# EAGLE design Envelopekut (EAGLE 9.6.2)
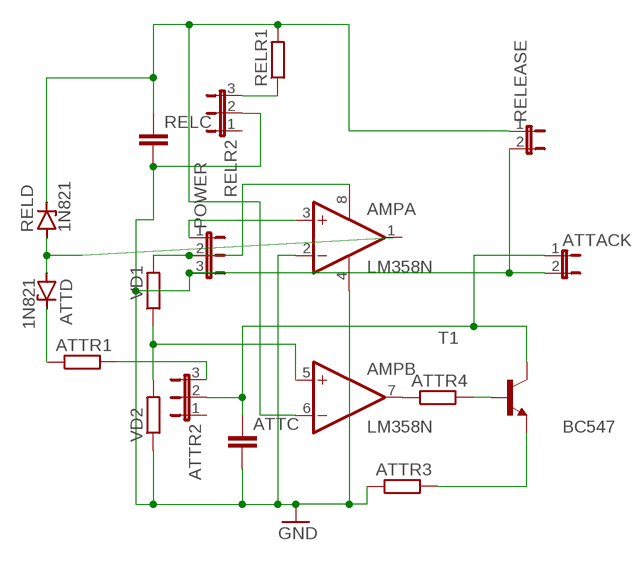
[diagram p0: schematic, sheet 1]

## Parts
AMP  LM358N  [DIL08]
ATTACK  JP1E  [JP1]
ATTC  C-EU025-025X050  [C025-025X050]
ATTD  1N821  [DO35Z10]
ATTR1  R-EU_0207/10  [0207/10]
ATTR2  JP2E  [JP2]
ATTR3  R-EU_0207/10  [0207/10]
ATTR4  R-EU_0207/10  [0207/10]
POWER  JP2E  [JP2]
RELC  C-EU025-025X050  [C025-025X050]
RELD  1N821  [DO35Z10]
RELEASE  JP1E  [JP1]
RELR1  R-EU_0207/10  [0207/10]
RELR2  JP2E  [JP2]
T1  BC547  [TO92]
VD1  R-EU_0207/10  [0207/10]
VD2  R-EU_0207/10  [0207/10]

## Nets
GND: AMP.2(A:-IN) AMP.4(P:V-) ATTACK.2 ATTC.2 ATTR3.1 POWER.3 RELC.2 RELEASE.2 RELR2.2 VD2.1
N$1: AMP.5(B:+IN) VD1.1 VD2.2
N$2: AMP.7(B:OUT) ATTR4.1
N$3: ATTR4.2 T1.2(B)
N$4: ATTR1.2 ATTR2.3
N$5: ATTR3.2 T1.1(E)
N$6: ATTACK.1 ATTC.1 ATTR2.2 T1.3(C)
N$7: ATTD.C ATTR1.1
N$8: AMP.1(A:OUT) ATTD.A RELD.A
N$9: AMP.8(P:V+) POWER.2 VD1.2
N$10: AMP.3(A:+IN) POWER.1
N$11: AMP.6(B:-IN) RELC.1 RELD.C RELEASE.1 RELR1.2
N$12: RELR1.1 RELR2.3
Unconnected: ATTR2.1 RELR2.1

## Library data of the parts
AMP = linear:LM358: OP AMP also LM158; LM258; LM2904 Source: http://cache.national.com/ds/LM/LM158.pdf
ATTACK RELEASE = jumper:JP1E: JUMPER
ATTC RELC = rcl:C-EU: CAPACITOR, European symbol; SPICEPREFIX: C
ATTD RELD = diode:1N821: Reference DIODE temperature compensated, 6,2 V
ATTR1 ATTR3 ATTR4 RELR1 VD1 VD2 = rcl:R-EU_: RESISTOR, European symbol; SPICEPREFIX: R
ATTR2 POWER RELR2 = jumper:JP2E: JUMPER
T1 = transistor:BC547: NPN TRANSISTOR

## Board
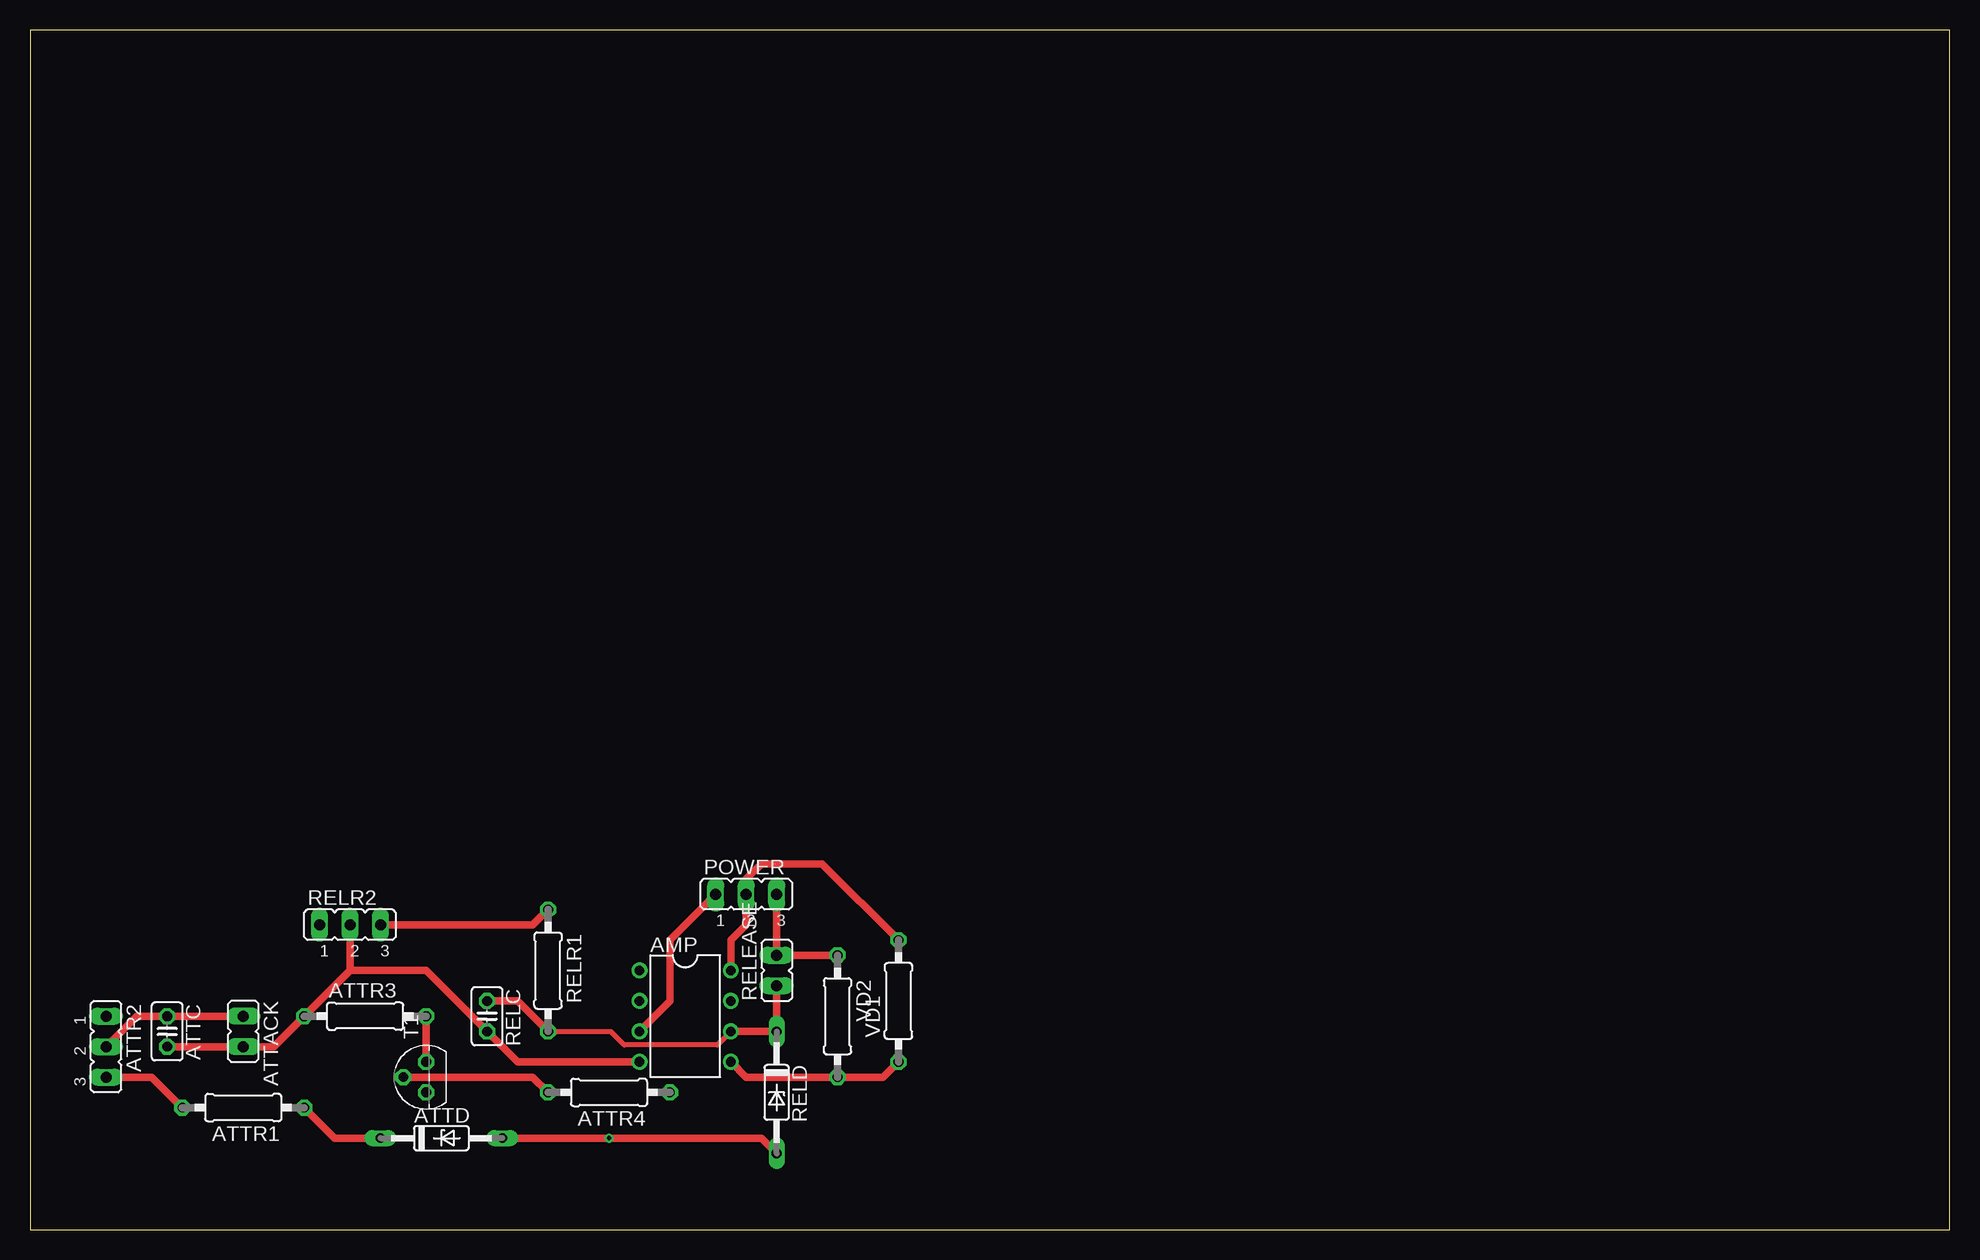
[diagram p1: board, top side]
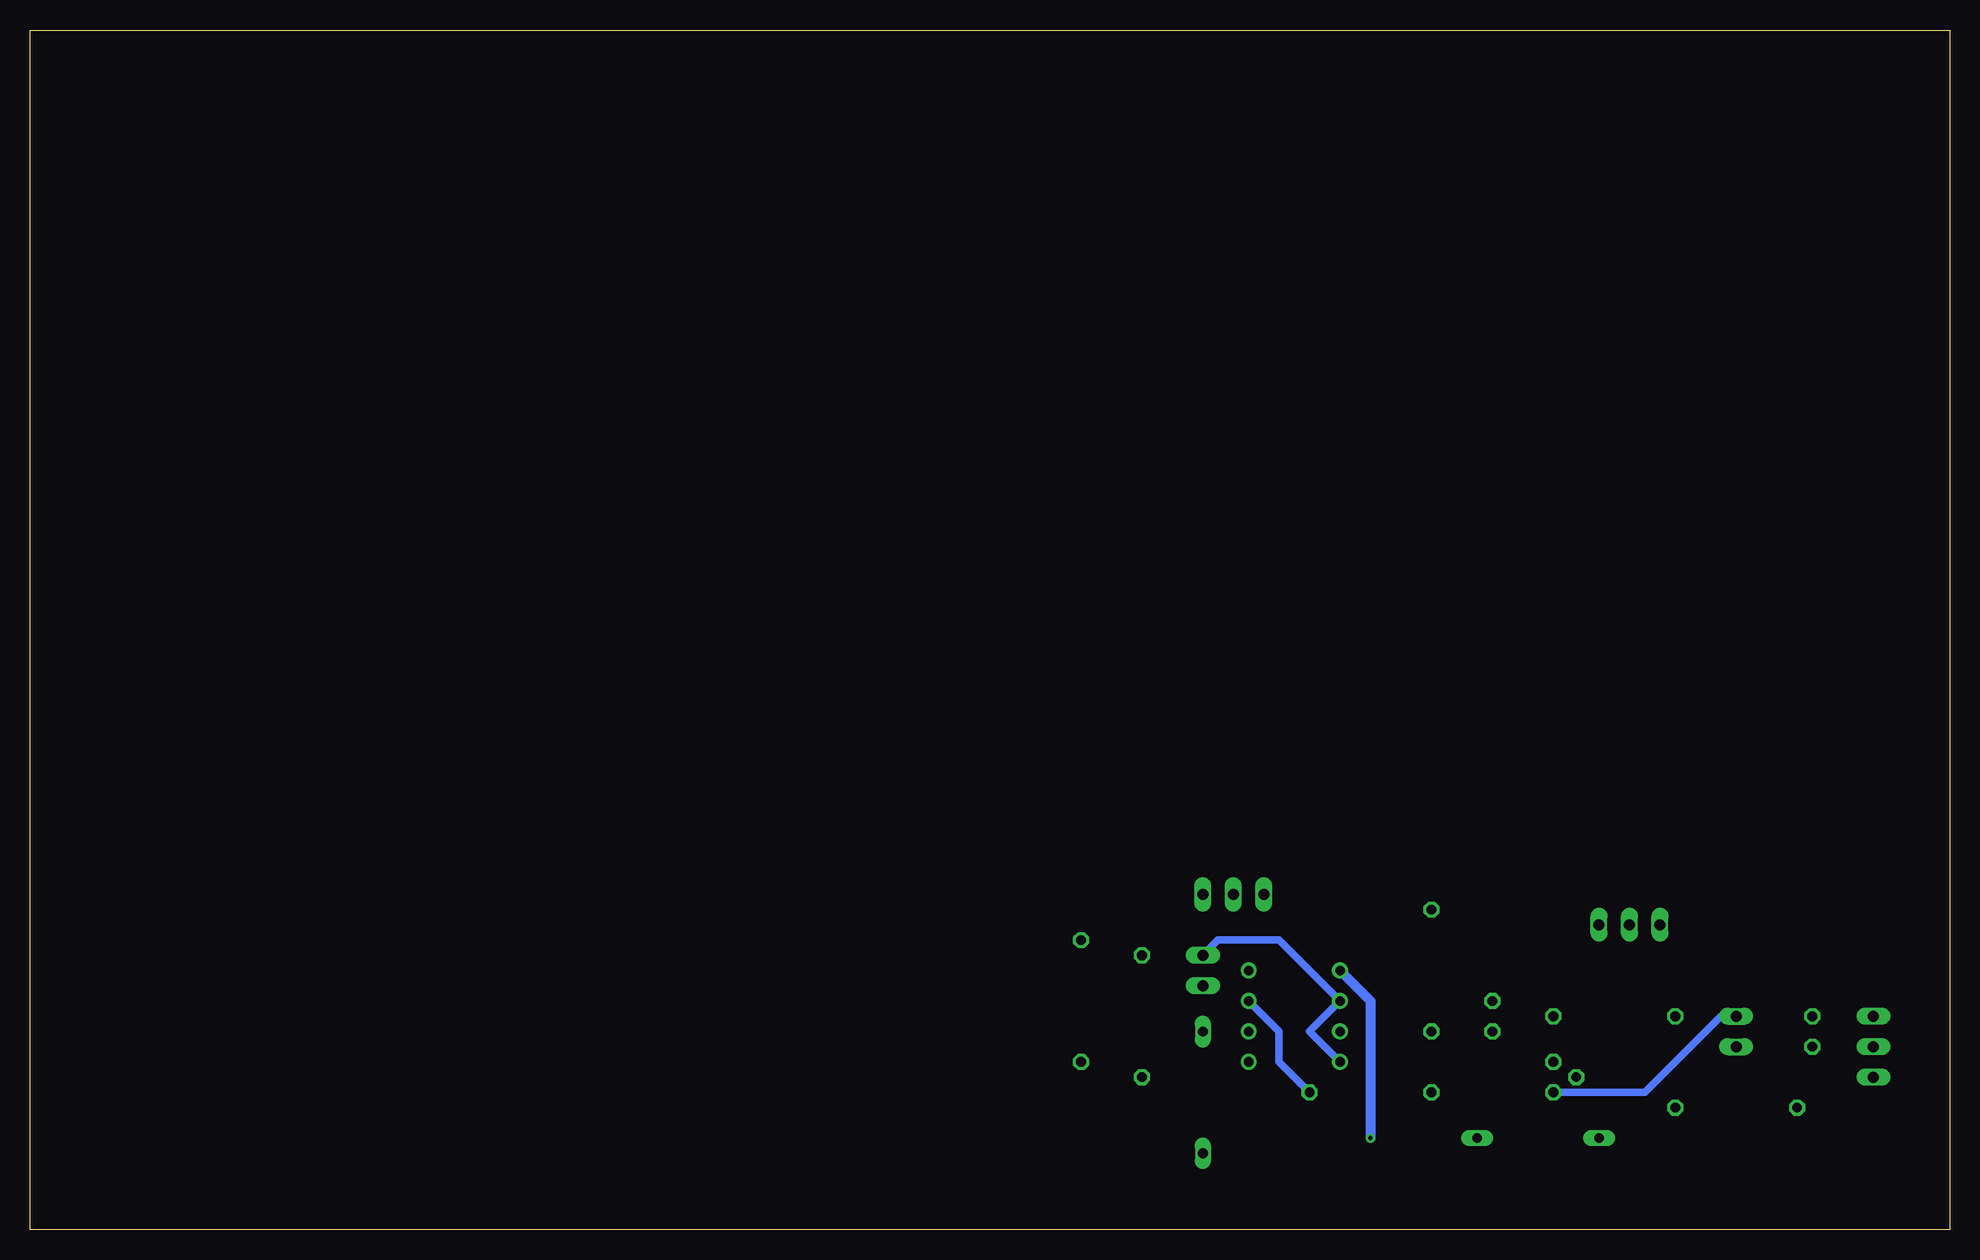
[diagram p2: board, bottom side, seen from below]

Size 160 x 100 mm. Coordinates in mm from the lower left corner, seen from the top.
Outline: 0,0 160,0 160,100 0,100 0,0
Copper layers (1*16): Top 0.035mm / dielectric 1.5mm / Bottom 0.035mm
Design rules "default": minimum track width 6mil, minimum drill 0.35mm, track to track 6mil, track to pad 6mil, pad to pad 6mil, via to via 6mil, smd to smd 6mil, copper to edge 40mil, drill to drill 6mil, minimum pad ring 10mil, minimum via ring 8mil, stop-mask expansion 4mil, vias tented up to drill 0mil, thermal gap 10mil

### Footprints (pad centres in the part's own frame; a part is rotated, then mirrored left to right if it is on the bottom)
DIL08 = drill 0.813 pad 1.27: 1 -3.81,-3.81; 2 -1.27,-3.81; 3 1.27,-3.81; 4 3.81,-3.81; 5 3.81,3.81; 6 1.27,3.81; 7 -1.27,3.81; 8 -3.81,3.81
JP1 = drill 0.914 long: 1 0,-1.27; 2 0,1.27
C025-025X050 = drill 0.813 octagon: 1 -1.27,0; 2 1.27,0
DO35Z10 = drill 0.813 long: A 5.08,0; C -5.08,0
0207/10 = drill 0.813 octagon: 1 -5.08,0; 2 5.08,0
JP2 = drill 0.914 long: 1 -2.54,0; 2 0,0; 3 2.54,0
TO92 = drill 0.813 octagon: 1 1.27,0; 2 0,1.905; 3 -1.27,0

### Placement (x,y rotation side)
AMP  54.61,17.78 270 top
ATTACK  17.78,16.51 180 top
ATTC  11.43,16.51 270 top
ATTD  34.29,7.62 0 top
ATTR1  17.78,10.16 180 top
ATTR2  6.35,15.24 270 top
ATTR3  27.94,17.78 0 top
ATTR4  48.26,11.43 180 top
POWER  59.69,27.94 0 top
RELC  38.1,17.78 270 top
RELD  62.23,11.43 270 top
RELEASE  62.23,21.59 0 top
RELR1  43.18,21.59 270 top
RELR2  26.67,25.4 0 top
T1  33.02,12.7 90 top
VD1  72.39,19.05 90 top
VD2  67.31,17.78 270 top

### Tracks (layer width: path | path; a pad name or v marks a point on that pad's centre or on a via)
GND
  Top 0.61: ATTC.2 ATTACK.2 20.32,15.24 ATTR3.1 26.67,21.59 | 26.67,21.59 RELR2.2 | AMP.4 40.64,13.97 RELC.2 33.02,21.59 26.67,21.59 | VD2.1 RELEASE.2 POWER.3
  Bottom 0.61: RELEASE.2 60.96,24.13 55.88,24.13 AMP.2 53.34,16.51 AMP.4
N$1
  Top 0.61: AMP.5 59.69,12.7 VD2.2 71.12,12.7 VD1.1
N$2
  Bottom 0.61: ATTR4.1 55.88,13.97 55.88,16.51 AMP.7
N$3
  Top 0.61: T1.2 41.91,12.7 ATTR4.2
N$4
  Top 0.61: ATTR1.2 10.16,12.7 ATTR2.3
N$5
  Top 0.61: T1.1 ATTR3.2
N$6
  Top 0.61: ATTR2.2 8.89,17.78 ATTC.1 ATTACK.1
  Bottom 0.61: T1.3 25.4,11.43 19.05,17.78 ATTACK.1
N$7
  Top 0.61: ATTD.C 25.4,7.62 ATTR1.1
N$8  (via drill 0.35)
  Top 0.152: v48.26,7.62 48.31,7.67 48.31,7.62
  Top 0.61: ATTD.A v48.26,7.62 48.31,7.62 60.96,7.62 RELD.A
  Bottom 0.813: AMP.1 48.26,19.05 v48.26,7.62
N$9
  Top 0.61: VD1.2 66.04,30.48 60.96,30.48 59.69,29.21 POWER.2 59.69,25.4 58.42,24.13 AMP.8
N$10
  Top 0.61: POWER.1 53.34,24.13 53.34,19.05 AMP.3
N$11
  Top 0.406: RELR1.2 48.41,16.51 49.53,15.39 57.3,15.39 AMP.6
  Top 0.61: RELC.1 40.64,19.05 RELR1.2 | RELEASE.1 RELD.C AMP.6
N$12
  Top 0.61: RELR2.3 41.91,25.4 RELR1.1